# Altium schematic sheet 08 - Resolver.SchDoc: Resolver - 25kW WolfPACK FM3 Six-Pack Inverter
size 431 x 279 mm; Date: 07/2023; DocumentNumber: CRD25DA12N-FMC; Revision: 1.1; SheetNumber: 8; SheetTotal: 8; SheetSize: B
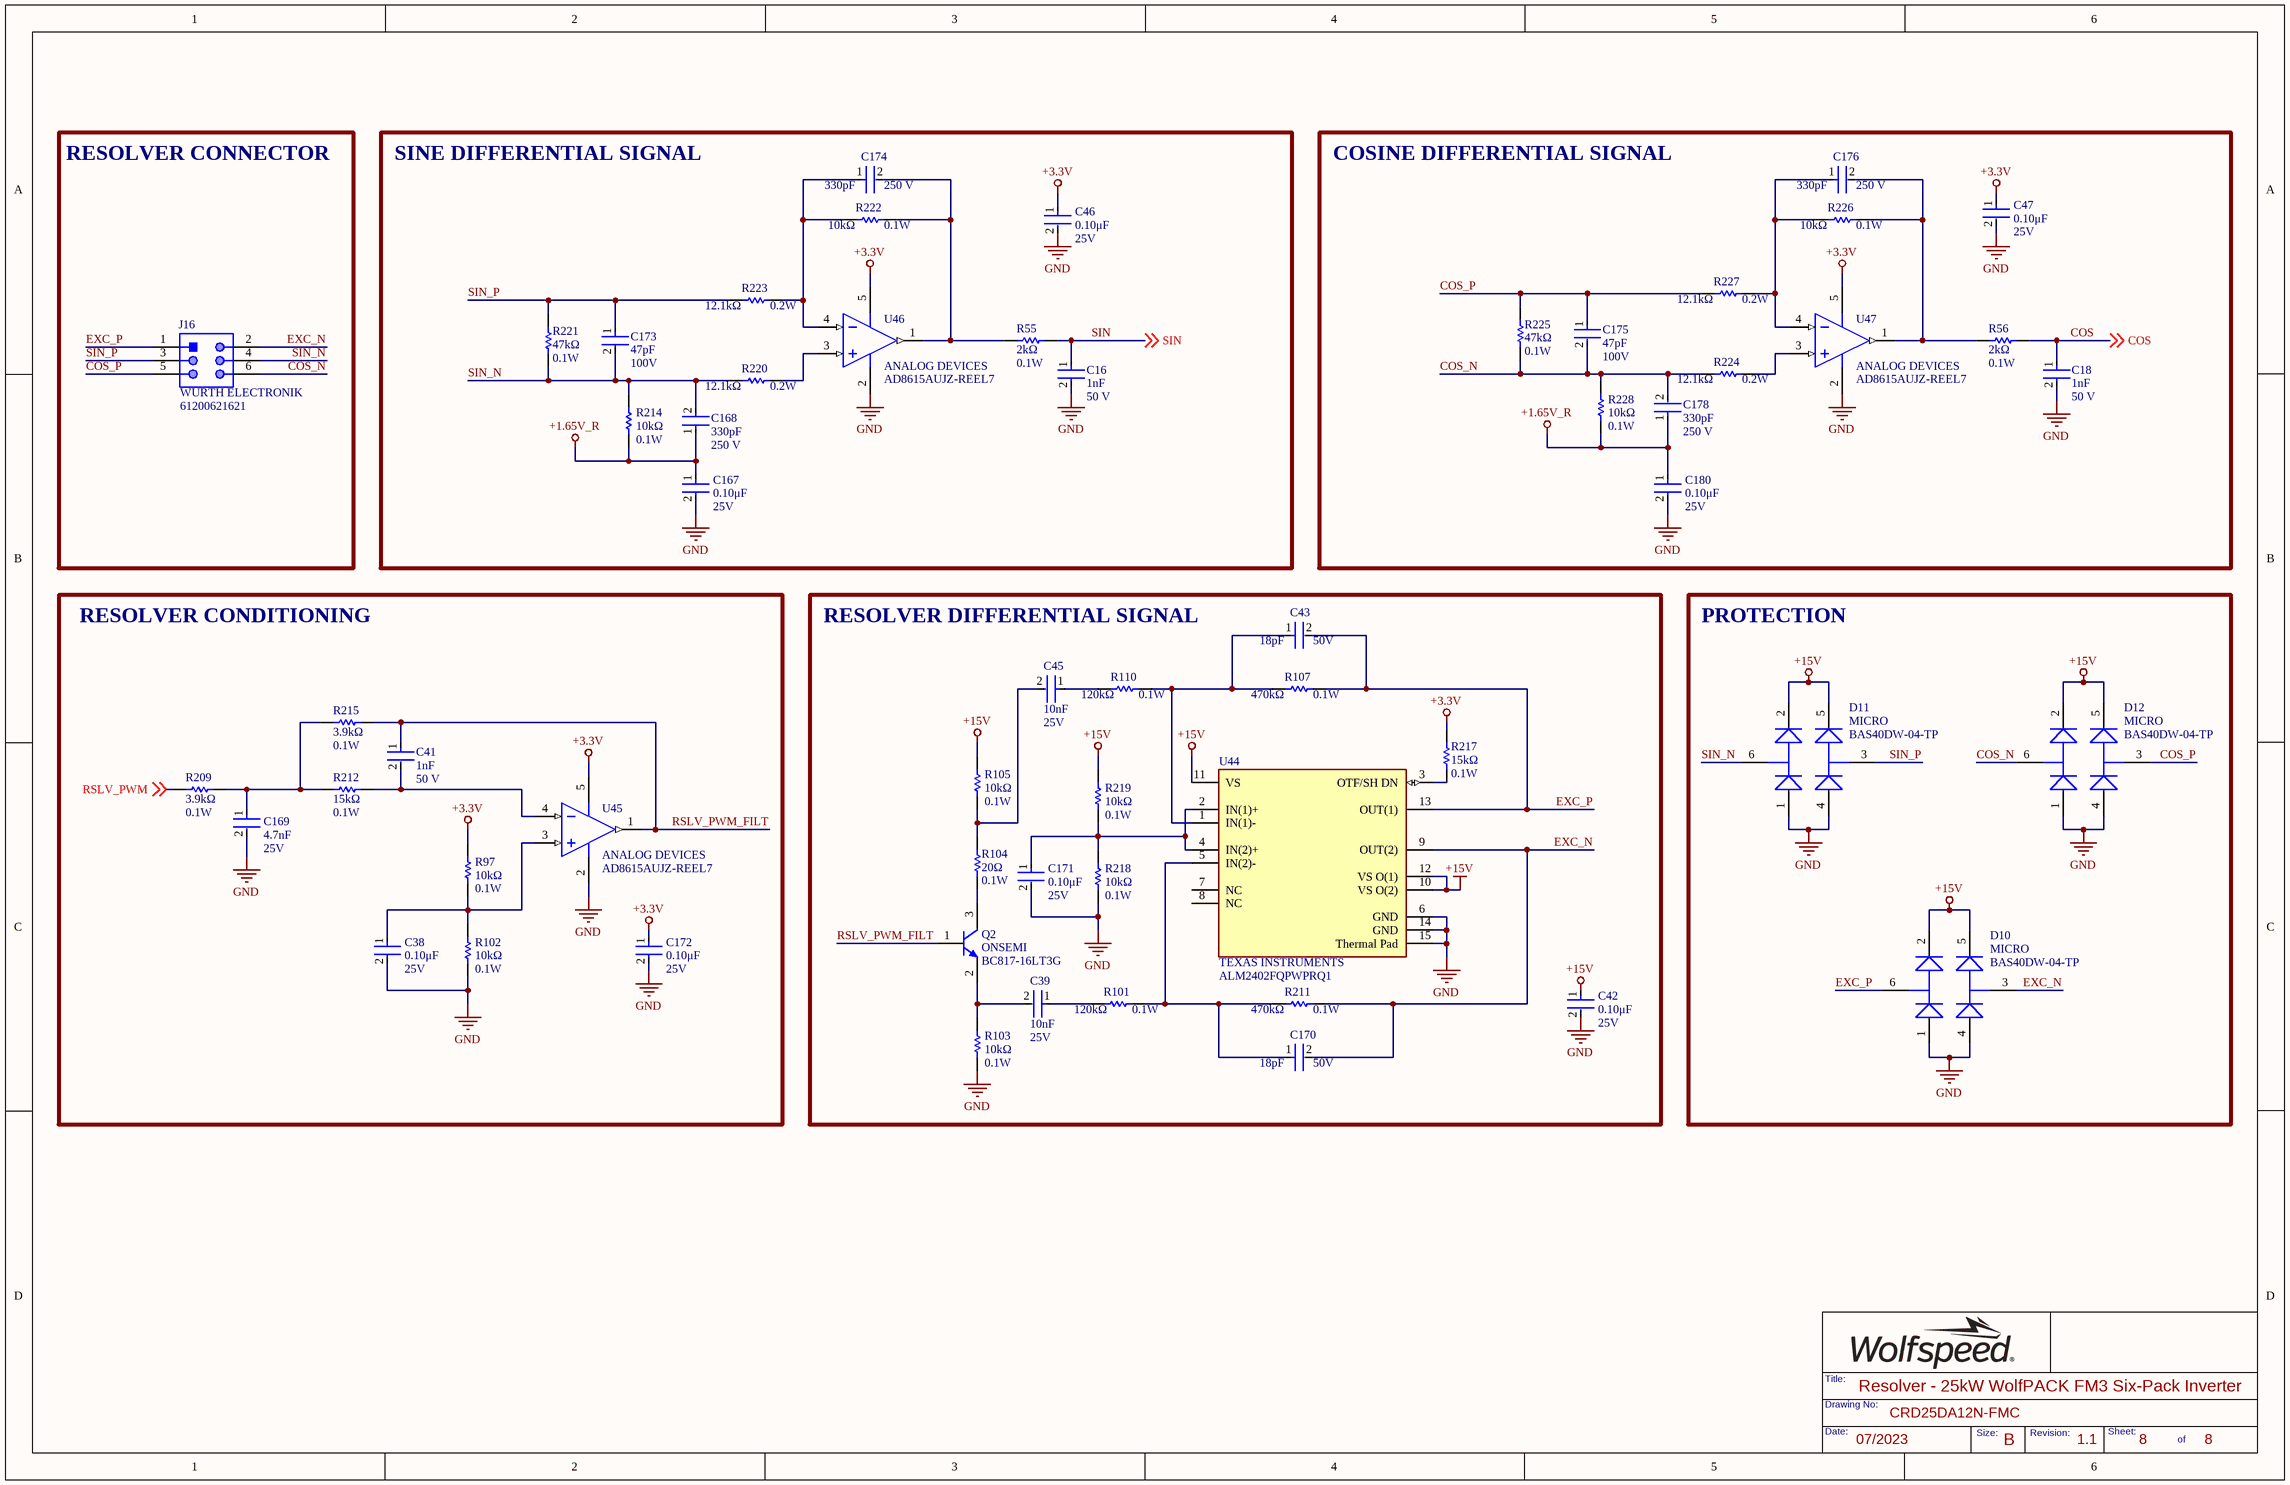
[diagram p0: 08 - Resolver.SchDoc]

## Parts
C16  Capacitance: 1nF  Voltage Rating: 50 V  [FP-C0603C-CF-IPC_B]  (hidden comment: C0603C102K5RACAUTO)
C18  Capacitance: 1nF  Voltage Rating: 50 V  [FP-C0603C-CF-IPC_B]  (hidden comment: C0603C102K5RACAUTO)
C38  Voltage Rating: 25V  Capacitance: 0.10μF  [FP-C0603C-CF-IPC_B]  (hidden comment: C0603C104K3RACTU)
C39  value 10nF  Voltage Rating: 25V  [FP-C0603C-CF-IPC_B]  (hidden comment: CL10B103KA8WPNC)
C41  Capacitance: 1nF  Voltage Rating: 50 V  [FP-C0603C-CF-IPC_B]  (hidden comment: C0603C102K5RACAUTO)
C42  Voltage Rating: 25V  Capacitance: 0.10μF  [FP-C0603C-CF-IPC_B]  (hidden comment: C0603C104K3RACTU)
C43  Capacitance: 18pF  Voltage Rating: 50V  [FP-C0603C-CF-IPC_B]  (hidden comment: 06035A180JAT2A)
C45  value 10nF  Voltage Rating: 25V  [FP-C0603C-CF-IPC_B]  (hidden comment: CL10B103KA8WPNC)
C46  Voltage Rating: 25V  Capacitance: 0.10μF  [FP-C0603C-CF-IPC_B]  (hidden comment: C0603C104K3RACTU)
C47  Voltage Rating: 25V  Capacitance: 0.10μF  [FP-C0603C-CF-IPC_B]  (hidden comment: C0603C104K3RACTU)
C167  Voltage Rating: 25V  Capacitance: 0.10μF  [FP-C0603C-CF-IPC_B]  (hidden comment: C0603C104K3RACTU)
C168  value 330pF  Voltage Rating: 250 V  [FP-C0603C-CF-IPC_B]  (hidden comment: C0603C331JAGAC7867)
C169  Voltage Rating: 25V  Capacitance: 4.7nF  [FP-C0603C-CF-IPC_B]  (hidden comment: C0603C472K3RAC7867)
C170  Capacitance: 18pF  Voltage Rating: 50V  [FP-C0603C-CF-IPC_B]  (hidden comment: 06035A180JAT2A)
C171  Voltage Rating: 25V  Capacitance: 0.10μF  [FP-C0603C-CF-IPC_B]  (hidden comment: C0603C104K3RACTU)
C172  Voltage Rating: 25V  Capacitance: 0.10μF  [FP-C0603C-CF-IPC_B]  (hidden comment: C0603C104K3RACTU)
C173  Capacitance: 47pF  Voltage Rating (DC): 100V  [FP-C0603C-CF-IPC_B]  (hidden comment: C0603C470J1GACTU)
C174  value 330pF  Voltage Rating: 250 V  [FP-C0603C-CF-IPC_B]  (hidden comment: C0603C331JAGAC7867)
C175  Capacitance: 47pF  Voltage Rating (DC): 100V  [FP-C0603C-CF-IPC_B]  (hidden comment: C0603C470J1GACTU)
C176  value 330pF  Voltage Rating: 250 V  [FP-C0603C-CF-IPC_B]  (hidden comment: C0603C331JAGAC7867)
C178  value 330pF  Voltage Rating: 250 V  [FP-C0603C-CF-IPC_B]  (hidden comment: C0603C331JAGAC7867)
C180  Voltage Rating: 25V  Capacitance: 0.10μF  [FP-C0603C-CF-IPC_B]  (hidden comment: C0603C104K3RACTU)
D10  Manufacturer Print: MICRO  [SOT65P222X120-6N]  (hidden comment: BAS40DW-04-TP)
D11  Manufacturer Print: MICRO  [SOT65P222X120-6N]  (hidden comment: BAS40DW-04-TP)
D12  Manufacturer Print: MICRO  [SOT65P222X120-6N]  (hidden comment: BAS40DW-04-TP)
J16  Manufacturer: WURTH ELECTRONIK  [61200621621]  (hidden comment: 61200621621)
Q2  Manufacturer: ONSEMI  [ONSC-SOT-23-3-318-08_V]  (hidden comment: BC817-16LT3G)
R55  Resistance: 2kΩ  Power Rating: 0.1W  [FP-MCR03-IPC_B]  (hidden comment: RT0603DRE072KL)
R56  Resistance: 2kΩ  Power Rating: 0.1W  [FP-MCR03-IPC_B]  (hidden comment: RT0603DRE072KL)
R97  Resistance: 10kΩ  Max Power Dissipation: 0.1W  [FP-MCR03-IPC_B]  (hidden comment: ERJ3EKF1002V)
R101  Max Power Dissipation: 0.1W  Resistance: 120kΩ  [FP-MCR03-IPC_B]  (hidden comment: RC0603FR-07120KL)
R102  Resistance: 10kΩ  Max Power Dissipation: 0.1W  [FP-MCR03-IPC_B]  (hidden comment: ERJ3EKF1002V)
R103  Resistance: 10kΩ  Max Power Dissipation: 0.1W  [FP-MCR03-IPC_B]  (hidden comment: ERJ3EKF1002V)
R104  Resistance: 20Ω  Power Rating: 0.1W  [FP-MCR03-IPC_B]  (hidden comment: RC0603JR-0720RL)
R105  Resistance: 10kΩ  Max Power Dissipation: 0.1W  [FP-MCR03-IPC_B]  (hidden comment: ERJ3EKF1002V)
R107  Resistance: 470kΩ  Power Rating: 0.1W  [FP-MCR03-IPC_B]  (hidden comment: RC0603FR-07470KL)
R110  Max Power Dissipation: 0.1W  Resistance: 120kΩ  [FP-MCR03-IPC_B]  (hidden comment: RC0603FR-07120KL)
R209  Resistance: 3.9kΩ  Power Rating: 0.1W  [FP-MCR03-IPC_B]  (hidden comment: ERJ3EKF3901V)
R211  Resistance: 470kΩ  Power Rating: 0.1W  [FP-MCR03-IPC_B]  (hidden comment: RC0603FR-07470KL)
R212  Resistance: 15kΩ  Power Rating: 0.1W  [FP-MCR03-IPC_B]  (hidden comment: ERA-3AED153V)
R214  Resistance: 10kΩ  Max Power Dissipation: 0.1W  [FP-MCR03-IPC_B]  (hidden comment: ERJ3EKF1002V)
R215  Resistance: 3.9kΩ  Power Rating: 0.1W  [FP-MCR03-IPC_B]  (hidden comment: ERJ3EKF3901V)
R217  Resistance: 15kΩ  Power Rating: 0.1W  [FP-MCR03-IPC_B]  (hidden comment: ERA-3AED153V)
R218  Resistance: 10kΩ  Max Power Dissipation: 0.1W  [FP-MCR03-IPC_B]  (hidden comment: ERJ3EKF1002V)
R219  Resistance: 10kΩ  Max Power Dissipation: 0.1W  [FP-MCR03-IPC_B]  (hidden comment: ERJ3EKF1002V)
R220  Resistance: 12.1kΩ  Max Power Dissipation: 0.2W  [FP-MCR03-IPC_B]  (hidden comment: ERJ-PB3B1212V)
R221  Resistance: 47kΩ  Power Rating: 0.1W  [FP-MCR03-IPC_B]  (hidden comment: RC0603FR-0747KL)
R222  Resistance: 10kΩ  Max Power Dissipation: 0.1W  [FP-MCR03-IPC_B]  (hidden comment: ERJ3EKF1002V)
R223  Resistance: 12.1kΩ  Max Power Dissipation: 0.2W  [FP-MCR03-IPC_B]  (hidden comment: ERJ-PB3B1212V)
R224  Resistance: 12.1kΩ  Max Power Dissipation: 0.2W  [FP-MCR03-IPC_B]  (hidden comment: ERJ-PB3B1212V)
R225  Resistance: 47kΩ  Power Rating: 0.1W  [FP-MCR03-IPC_B]  (hidden comment: RC0603FR-0747KL)
R226  Resistance: 10kΩ  Max Power Dissipation: 0.1W  [FP-MCR03-IPC_B]  (hidden comment: ERJ3EKF1002V)
R227  Resistance: 12.1kΩ  Max Power Dissipation: 0.2W  [FP-MCR03-IPC_B]  (hidden comment: ERJ-PB3B1212V)
R228  Resistance: 10kΩ  Max Power Dissipation: 0.1W  [FP-MCR03-IPC_B]  (hidden comment: ERJ3EKF1002V)
U44  Manufacturer: TEXAS INSTRUMENTS  [FP-PWP0014H-MFG]  (hidden comment: ALM2402FQPWPRQ1)
U45  Manufacturer: ANALOG DEVICES  [ADI-UJ-5_M]  (hidden comment: AD8615AUJZ-REEL7)
U46  Manufacturer: ANALOG DEVICES  [ADI-UJ-5_M]  (hidden comment: AD8615AUJZ-REEL7)
U47  Manufacturer: ANALOG DEVICES  [ADI-UJ-5_M]  (hidden comment: AD8615AUJZ-REEL7)

## Blocks framed on the sheet
RESOLVER CONNECTOR: J16
SINE DIFFERENTIAL SIGNAL: C16 C46 C167 C168 C173 C174 R55 R214 R220-R223 U46
COSINE DIFFERENTIAL SIGNAL: C18 C47 C175 C176 C178 C180 R56 R224-R228 U47
RESOLVER CONDITIONING: C38 C41 C169 C172 R97 R102 R209 R212 R215 U45
RESOLVER DIFFERENTIAL SIGNAL: C39 C42 C43 C45 C170 C171 Q2 R101 R103-R105 R107 R110 R211 R217-R219 U44
PROTECTION: D10-D12

## Nets
+1.65V_R: C167.1 C168.1 C178.1 C180.1 R214.1 R228.1
+3.3V: C46.1 C47.1 C172.1 R97.2 R217.2 U45.5(+V) U46.5(+V) U47.5(+V)
+15V: C42.1 D10.2(C1) D10.5(C2) D11.2(C1) D11.5(C2) D12.2(C1) D12.5(C2) R105.2 R219.2 U44.10(VS_O(2)) U44.11(VS) U44.12(VS_O(1))
GND: C16.2 C18.2 C38.2 C42.2 C46.2 C47.2 C167.2 C169.2 C171.2 C172.2 C180.2 D10.1(A1) D10.4(A2) D11.1(A1) D11.4(A2) D12.1(A1) D12.4(A2) R102.1 R103.1 R218.1 U44.6(GND) U44.14(GND) U44.15(Thermal_Pad) U45.2(-V) U46.2(-V) U47.2(-V)
COS: C18.1 R56.2 ; off-sheet COS
COS_N: C175.2 C178.2 D12.6(AC1) J16.6 R224.1 R225.1 R228.2
COS_P: C175.1 D12.3(AC2) J16.5 R225.2 R227.1
EXC_N: C170.2 D10.3(AC2) J16.2 R211.2 U44.9(OUT(2))
EXC_P: C43.2 D10.6(AC1) J16.1 R107.2 U44.13(OUT(1))
RSLV_PWM: R209.1 ; off-sheet RSLV_PWM
RSLV_PWM_FILT: C41.1 Q2.1(B) R215.2 U45.1(OUT)
SIN: C16.1 R55.2 ; off-sheet SIN
SIN_N: C168.2 C173.2 D11.6(AC1) J16.4 R214.2 R220.1 R221.1
SIN_P: C173.1 D11.3(AC2) J16.3 R221.2 R223.1
NetC38_1: C38.1 R97.1 R102.2 U45.3(+IN)
NetC39_1: C39.1 R101.1
NetC39_2: C39.2 Q2.2(E) R103.2
NetC41_2: C41.2 R212.1 U45.4(-IN)
NetC43_1: C43.1 R107.1 R110.2 U44.1(IN(1)-)
NetC45_1: C45.1 R110.1
NetC45_2: C45.2 R104.2 R105.1
NetC169_1: C169.1 R209.2 R212.2 R215.1
NetC170_1: C170.1 R101.2 R211.1 U44.5(IN(2)-)
NetC171_1: C171.1 R218.2 R219.1 U44.2(IN(1)+) U44.4(IN(2)+)
NetC174_1: C174.1 R222.2 R223.2 U46.4(-IN)
NetC174_2: C174.2 R55.1 R222.1 U46.1(OUT)
NetC176_1: C176.1 R226.2 R227.2 U47.4(-IN)
NetC176_2: C176.2 R56.1 R226.1 U47.1(OUT)
NetQ2_3: Q2.3(C) R104.1
NetR217_1: R217.1 U44.3(OTF/SH_DN)
NetR220_2: R220.2 U46.3(+IN)
NetR224_2: R224.2 U47.3(+IN)

Not connected (* = marked no-connect by the designer): U44 7(NC) 8(NC)

## Notes on the sheet
- Title:
- Date:
- Drawing No:
- Size:
- Revision:
- Sheet:
- of

## Library data of the parts
C16 C18 C41 = CMP-2006-03716-2: CAP CER 1000PF 50V X7R 0603; Manufacturer: KEMET; Material: Ceramic; Automotive Grade: Grade 1; Value: 1nF; Tolerance: 0.1; Temperature Coefficient: 30ppm/°C; Category: Cap; Automotive: Yes; Temperature Range High: +125°C; Temperature Range Low: -55°C; Temperature Characteristic: X7R; Device Class L1: Passive Components; Height: 0.87mm; Lead Free: Yes; Package: 0603; Digikey Description: CAP CER 1000PF 50V X7R 0603; Manufacturer Part Number: C0603C102K5RACAUTO; ComponentLink2URL: https://api.kemet.com/component-edge/download/datasheet/C0603C100J5GACAUTO.pdf; Mouser Description: Multilayer Ceramic Capacitors MLCC - SMD/SMT 1000pF 50volts 10% X7R AUTO; RoHS: TRUE; Octopart: https://octopart.com/c0603c102k5racauto-kemet-18822673; Device Class L3: Ceramic Capacitors; ComponentLink2Description: Datasheet; Device Class L2: Capacitors; Temperature: -55°C to +125°C
C38 C42 C46 C47 C167 C171 C172 C180 = CMP-2006-03057-2: CAP CER 0.1UF 25V X7R 0603; Manufacturer: KEMET; Value: 0.10μF; Material: Ceramic; Tolerance: 0.1; Temperature Coefficient: 30ppm/°C; Automotive Grade: Grade 1; Lead Free: Yes; Device Class L3: Ceramic Capacitors; Manufacturer Part Number: C0603C104K3RACTU; Digikey Description: CAP CER 0.1UF 25V X7R 0603; Mouser Description: Multilayer Ceramic Capacitors MLCC - SMD/SMT 25volts 0.1uF X7R 10%; Package: 0603; Temperature Range Low: -55°C; Automotive: Yes; Device Class L2: Capacitors; Octopart: https://octopart.com/c0603c104k3ractu-kemet-127541; ComponentLink2Description: Datasheet; ComponentLink2URL: https://api.kemet.com/component-edge/download/datasheet/C0603C100J5GACAUTO.pdf; Temperature Range High: +125°C; RoHS: TRUE; Device Class L1: Passive Components; Category: Cap; Temperature: -55°C to +125°C; Height: 0.87mm; Temperature Characteristic: X7R
C39 C45 = CL10B103KA8WPNC: CAP CER 10000PF 25V X7R 0603; Manufacturer: SAMSUNG; Tolerance: 10%; Supplier 1: Arrow Electronics; Manufacturer Part Number: CL10B103KA8WPNC; RoHS: Yes; Category: Ceramic Capacitors; Stock 1: 144000; Pricing 1: 4000=0.00760, 8000=0.00670, 28000=0.00660, 100000=0.00500 (USD); Mount: Surface Mount; Package: 0603; Case Code (Metric): 1608; Case Code (Imperial): 0603; Min Operating Temperature: -55°C; Max Operating Temperature: 125°C; Packaging: Tape and Reel; Capacitance: 10nF; Features: Soft Termination; Length: 0.063inch; Width: 0.031inch; Thickness: 0.035inch; Ratings: AEC-Q200; RoHS Compliant: Yes; ComponentLink1URL: http://www.samsungsem.com/kr/support/product-search/mlcc/CL10B103KA8WPNC.jsp?src-supplier=Digi-Key; ComponentLink1Description: http://www.samsungsem.com/kr/support/product-search/mlcc/CL10B103KA8WPNC.jsp?src-supplier=Digi-Key; ComponentLink2URL: http://www.samsungsem.com/kr/support/library/product-catalog/mlcc.jsp?src-supplier=Digi-Key; ComponentLink2Description: http://www.samsungsem.com/kr/support/library/product-catalog/mlcc.jsp?src-supplier=Digi-Key; ComponentLink3URL: http://www.samsungsem.com/servlet/FileDownload?filename=productcatalog/pdf/MLCC.pdf&src-supplier=Avnet; ComponentLink3Description: http://www.samsungsem.com/servlet/FileDownload?filename=productcatalog/pdf/MLCC.pdf&src-supplier=Avnet; Supplier Part Number 1: CL10B103KA8WPNC
C43 C170 = 06035A180JAT2A: CAP CER 18PF 50V C0G/NP0 0603; Manufacturer: KYOCERA AVX; Dielectric Material: Ceramic; Tolerance: 5%; Dielectric: C0G; Insulation Resistance: 100GR; Temperature Coefficient: 30ppm/°C; Supplier 1: Rs; Manufacturer Part Number: 06035A180JAT2A; RoHS: Yes; Category: Ceramic Capacitors; Stock 1: 1; Pricing 1: 4000=0.01900, 12000=0.01700 (USD); Mount: Surface Mount; Number of Pins: 2; Case Code (Imperial): 0603; Case Code (Metric): 1608; Contact Plating: Tin,Matte; Min Operating Temperature: -55°C; Max Operating Temperature: 125°C; Packaging: Tape and Reel; Voltage Rating (DC): 50V; Series: -; Package Quantity: 1; Termination: SMD/SMT; Voltage: 50V; Length: 1.6mm; Width: 0.032inch; Height: 0.86mm; Thickness: 0.035inch; Depth: 0.81mm; Radiation Hardening: No; Reach SVHC Compliant: Yes; Lead Free: Lead Free; RoHS Compliant: Yes; ComponentLink1URL: https://datasheet.ciiva.com/1124/84496-1124722.pdf?src-supplier=Element14; ComponentLink1Description: https://datasheet.ciiva.com/1124/84496-1124722.pdf?src-supplier=Element14; ComponentLink2URL: https://datasheet.ciiva.com/22699/84496-22699967.pdf?src-supplier=Element14; ComponentLink2Description: https://datasheet.ciiva.com/22699/84496-22699967.pdf?src-supplier=Element14; ComponentLink3URL: https://datasheet.ciiva.com/7855/759117-7855062.pdf?src-supplier=Element14; ComponentLink3Description: https://datasheet.ciiva.com/7855/759117-7855062.pdf?src-supplier=Element14; ComponentLink4URL: https://datasheet.ciiva.com/7855/84496-7855222.pdf?src-supplier=Element14; ComponentLink4Description: https://datasheet.ciiva.com/7855/84496-7855222.pdf?src-supplier=Element14; ComponentLink5URL: https://datasheet.ciiva.com/150/ccog-150276.pdf?src-supplier=Digi-Key; ComponentLink5Description: https://datasheet.ciiva.com/150/ccog-150276.pdf?src-supplier=Digi-Key; ComponentLink6URL: https://datasheet.ciiva.com/150/ccog-150277.pdf?src-supplier=Digi-Key; ComponentLink6Description: https://datasheet.ciiva.com/150/ccog-150277.pdf?src-supplier=Digi-Key; Supplier Part Number 1: 1349617; Package: 0603; Value: 18pF
C168 C174 C176 C178 = CMP-03020-020944-2: CAP CER 330PF 250V C0G/NP0 0603; Manufacturer: KEMET; Material: Ceramic; Temperature Coefficient: 30ppm/°C; Tolerance: 0.05; Automotive Grade: Grade 1; Temperature Characteristic: C0G; Octopart: https://octopart.com/c0603c331jagac7867-kemet-83501965; Manufacturer Part Number: C0603C331JAGAC7867; Height: 0.87mm; ComponentLink2URL: https://api.kemet.com/component-edge/download/datasheet/C0603C100J5GACAUTO.pdf; Capacitance: 330pF; Package: 0603; Category: Cap; Temperature Range High: +125°C; RoHS: TRUE; ComponentLink2Description: Datasheet; Automotive: Yes; Temperature Range Low: -55°C; Temperature: -55°C to +125°C; Device Class L3: Ceramic Capacitors; Device Class L2: Capacitors; Digikey Description: Cap Ceramic 330pF 250V C0G 5% SMD 0603 125°C Paper T/R; Device Class L1: Passive Components; Lead Free: Yes
C169 = C0603C472K3RAC7867: CAP CER 4700PF 25V 10% X7R 0603; Manufacturer: KEMET; Manufacturer Part Number: C0603C472K3RACTU; Dielectric Material: Ceramic; Value: 4.7nF; Supplier 1: Newark; RoHS: Yes; Category: Ceramic Capacitors; Stock 1: 8000; Pricing 1: 1=0.04800, 4000=0.04800 (USD); Mount: Surface Mount; Package: 0603; Case Code (Metric): 1608; Case Code (Imperial): 0603; Min Operating Temperature: -55°C; Max Operating Temperature: 125°C; Tolerance: 10%; Dielectric: X7R; Packaging: Tape and Reel; Package Quantity: 1; Voltage Rating (DC): 25V; Termination: SMD/SMT; Dissipation Factor: 10%; Series: C; Construction: Flat; Length: 1.6mm; Width: 0.031inch; Height: 0.8mm; Thickness: 0.034inch; Lead Pitch: 0.7mm; Depth: 0.8mm; Radiation Hardening: No; Reach SVHC Compliant: Yes; RoHS Compliant: Yes; ComponentLink1URL: https://datasheet.ciiva.com/5414/kem-c1002-x7r-smd-357932-5414293.pdf?src-supplier=Mouser; ComponentLink1Description: https://datasheet.ciiva.com/5414/kem-c1002-x7r-smd-357932-5414293.pdf?src-supplier=Mouser; Supplier Part Number 1: 67AH9250
C173 C175 = C0603C470J1GACTU: CAP CER 47PF 100V C0G/NP0 0603; Manufacturer: KEMET; Dielectric Material: Ceramic; Tolerance: 5%; Dielectric: C0G; Temperature Coefficient: 30ppm/°C; Dissipation Factor: 0.1%; Supplier 1: Rs; Manufacturer Part Number: C0603C470J1GACTU; RoHS: Yes; Category: Ceramic Capacitors; Stock 1: 1; Pricing 1: 100=0.04300, 1000=0.03200, 2000=0.02200, 4000=0.02100, 8000=0.02000 (USD); Mount: Surface Mount,PCB; Package: 0603; Number of Pins: 2; Case Code (Imperial): 0603; Case Code (Metric): 1608; Min Operating Temperature: -55°C; Max Operating Temperature: 125°C; Package Quantity: 4000; Voltage Rating: 100V; Packaging: Tape and Reel; Termination: SMD/SMT; Voltage: 100V; Series: C; Construction: Flat; Length: 1.6mm; Width: 0.031inch; Height: 0.8mm; Lead Pitch: 0.7mm; Thickness: 0.034inch; Depth: 0.8mm; Radiation Hardening: No; Reach SVHC Compliant: Yes; Lead Free: Lead Free; RoHS Compliant: Yes; ComponentLink1URL: https://datasheet.ciiva.com/28668/1789732-28668693.pdf?src-supplier=Element14; ComponentLink1Description: https://datasheet.ciiva.com/28668/1789732-28668693.pdf?src-supplier=Element14; Supplier Part Number 1: 8015369; Value: 47pF
D10-D12 = BAS40DW-04-TP: DIODE ARRAY SCHOTTKY 40V SOT363; Manufacturer_Name: Micro Commercial Components (MCC); Manufacturer: MICRO COMMERCIAL; Class: DIO; Height: 1.2mm; Manufacturer_Part_Number: BAS40DW-04-TP; Package: SOT-363; Value: N/A; Manufacturer Part Number: BAS40DW-04-TP
J16 = CMP-1502-00000-1: CONN HEADER VERT 6POS 2.54MM; Withstanding Voltage: 500VAC; Working Voltage: 250VAC; Pin Number: 6; Gender: Male; Contact Resistance: 20mOhm; Manufacturer Part Number: 61200621621; Manufacturer URL: http://www.we-online.de; Published Date: August2018; Orientation: Vertical; Publisher: WurthElektronik; Operating Temperature: -40to125degC; Datasheet URL: https://katalog.we-online.de/em/datasheet/6120xx21621.pdf; Pitch: 2.54mm; Mounting Technology: THT; Packaging: Tray; Package Reference: 61200621621; Value: N/A; Package: N/A
Q2 = CMP-1048-00731-1: TRANS NPN 45V 0.5A SOT23-3; IC Continuous (A): 0.5; Packing: Tape and Reel; fT Min (MHz): 100; PartNumber: BC817-16LT3G; DatasheetVersion: Rev. 12; ComponentLink3URL: http://www.onsemi.cn/pub_link/Collateral/318-08.PDF; PackageDescription: 3-Pin Small Outline Transistor, Body 2.92 x 1.3 mm, Pitch 0.95 mm; Polarity: NPN; ComponentLink3Description: Package Specification; Mounting Technology: Surface Mount; PackageReference: SOT-23-3-318-08; RoHS: TRUE; ComponentLink1Description: Manufacturer URL; PackageVersion: Rev. AP, 11/2009; ComponentLink2URL: http://www.onsemi.com/pub_link/Collateral/BC817-16LT1-D.PDF; ComponentLink2Description: Datasheet; ComponentLink1URL: http://www.onsemi.com/; Package: SOT-23-3; Value: N/A; Manufacturer Part Number: BC817-16LT3G
R55 R56 = RT0603DRE072KL: RES SMD 2K OHM 0.5% 1/10W 0603; Manufacturer: YAGEO; Temperature Coefficient: 50ppm/°C; Voltage Rating: 75V; Max Power Dissipation: 100mW; Voltage Rating (DC): 50V; Value: 2kΩ; Supplier 1: Future Electronics; Manufacturer Part Number: RT0603DRE072KL; RoHS: Yes; Category: Chip SMD Resistors; Stock 1: 5000; Pricing 1: 5000=0.00650, 20000=0.00620, 75000=0.00590, 125000=0.00580, 250000=0.00550 (USD); Package: 0603; Contact Plating: Tin,Matte; Case Code (Metric): 1608; Case Code (Imperial): 0603; Min Operating Temperature: -55°C; Max Operating Temperature: 125°C; Tolerance: 0.5%; Resistor Type: Thin Film; Packaging: Tape and Reel; Package Quantity: 5000; Number of Terminations: 2; Termination: SMD/SMT; Features: Moisture Resistant; Series: RT; Construction: Rectangular; Length: 0.063inch; Width: 0.031inch; Height: 0.022inch; Depth: 0.8mm; Radiation Hardening: No; Military Standard: Not; Lead Free: Lead Free; RoHS Compliant: Yes; ComponentLink1URL: https://datasheet.ciiva.com/2566/pyu-rt-1-to-0-05-rohs-l-5-2566187.pdf?src-supplier=Digi-Key; ComponentLink1Description: https://datasheet.ciiva.com/2566/pyu-rt-1-to-0-05-rohs-l-5-2566187.pdf?src-supplier=Digi-Key; ComponentLink2URL: https://datasheet.ciiva.com/12705/pyu-rt-1-to-0-05-rohs-l-4-12705391.pdf?src-supplier=Mouser; ComponentLink2Description: https://datasheet.ciiva.com/12705/pyu-rt-1-to-0-05-rohs-l-4-12705391.pdf?src-supplier=Mouser; Supplier Part Number 1: 6165116
R97 R102 R103 R105 R214 R218 R219 R222 R226 R228 = ERJ3EKF1002V: RES SMD 10K OHM 1% 1/10W 0603; Manufacturer: PANASONIC; Manufacturer Part Number: ERJ-3EKF1002V; Temperature Coefficient: 100ppm/°C; Power Rating: 100mW; Voltage Rating: 75V; Value: 10kΩ; Supplier 1: Rs; RoHS: Yes; Category: Chip SMD Resistors; Stock 1: 10000; Mount: Surface Mount; Package: 0603; Number of Pins: 2; Contact Plating: Tin; Case Code (Metric): 1608; Case Code (Imperial): 0603; Size Code: 0603; Min Operating Temperature: -55°C; Max Operating Temperature: 155°C; Tolerance: 1%; Resistor Type: Thick Film; Packaging: Tape and Reel; Package Quantity: 1; Number of Terminations: 2; Termination: SMD/SMT; Voltage Rating (DC): 75V; Features: Automotive AEC-Q200; Series: ERJ; Technology: THICK FILM; Resistance Tolerance: 1%; Construction: Rectangular; Length: 1.6mm; Width: 0.8mm; Height: 0.45mm; Depth: 0.8mm; Radiation Hardening: No; Reach SVHC Compliant: Yes; Military Standard: Not; Lead Free: Lead Free; RoHS Compliant: Yes; ComponentLink1URL: https://datasheet.ciiva.com/7830/aoa0000ce2-7830729.pdf?src-supplier=Element14; ComponentLink1Description: https://datasheet.ciiva.com/7830/aoa0000ce2-7830729.pdf?src-supplier=Element14; ComponentLink2URL: https://datasheet.ciiva.com/46372/1678782-46372725.pdf?src-supplier=Element14; ComponentLink2Description: https://datasheet.ciiva.com/46372/1678782-46372725.pdf?src-supplier=Element14; ComponentLink3URL: https://datasheet.ciiva.com/28514/426256-28514198.pdf?src-supplier=Element14; ComponentLink3Description: https://datasheet.ciiva.com/28514/426256-28514198.pdf?src-supplier=Element14; ComponentLink4URL: https://datasheet.ciiva.com/24070/aoa0000ce2-24070318.pdf?src-supplier=Mouser; ComponentLink4Description: https://datasheet.ciiva.com/24070/aoa0000ce2-24070318.pdf?src-supplier=Mouser; ComponentLink5URL: https://datasheet.ciiva.com/16759/70260748-16759807.pdf?src-supplier=Allied+Electronics; ComponentLink5Description: https://datasheet.ciiva.com/16759/70260748-16759807.pdf?src-supplier=Allied+Electronics; ComponentLink6URL: https://datasheet.ciiva.com/9194/aoa0000ce2-9194199.pdf?src-supplier=Avnet; ComponentLink6Description: https://datasheet.ciiva.com/9194/aoa0000ce2-9194199.pdf?src-supplier=Avnet; ComponentLink7URL: https://datasheet.ciiva.com/48530/aoa0000ce2-48530988.pdf?src-supplier=Avnet; ComponentLink7Description: https://datasheet.ciiva.com/48530/aoa0000ce2-48530988.pdf?src-supplier=Avnet; ComponentLink8URL: https://datasheet.ciiva.com/30208/aoa0000ce2-30208985.pdf?src-supplier=Onlinecomponents.com; ComponentLink8Description: https://datasheet.ciiva.com/30208/aoa0000ce2-30208985.pdf?src-supplier=Onlinecomponents.com; Supplier Part Number 1: 1051156
R101 R110 = RC0603FR-07120KL: RES 120K OHM 1% 1/10W 0603; Manufacturer: YAGEO; Power Rating: 100mW; Voltage Rating: 50V; Temperature Coefficient: 100ppm/°C; Working Voltage: 75V; Value: 120kΩ; Supplier 1: Future Electronics; Manufacturer Part Number: RC0603FR-07120KL; RoHS: Yes; Category: Chip SMD Resistors; Stock 1: 4140000; Pricing 1: 5000=0.00150, 75000=0.00140, 200000=0.00140, 750000=0.00130, 2000000=0.00120 (USD); Package: 0603; Number of Pins: 2; Case Code (Metric): 1608; Case Code (Imperial): 0603; Min Operating Temperature: -55°C; Max Operating Temperature: 155°C; Tolerance: 1%; Resistor Type: Thick Film; Voltage Rating (DC): 50V; Package Quantity: 5000; Packaging: Tape and Reel; Number of Terminations: 2; Termination: SMD/SMT; Features: Moisture Resistant; Series: RC; Resistance Tolerance: 1%; Technology: THICK FILM; Length: 0.063inch; Width: 0.031inch; Height: 0.022inch; Depth: 0.8mm; RoHS Compliant: Yes; Lead Free: Lead Free; ComponentLink1URL: https://datasheet.ciiva.com/11808/0900766b80f96399-11808757.pdf?src-supplier=Rs; ComponentLink1Description: https://datasheet.ciiva.com/11808/0900766b80f96399-11808757.pdf?src-supplier=Rs; ComponentLink2URL: https://datasheet.ciiva.com/2454/pyu-r-int-thick-7-2454739.pdf?src-supplier=Digi-Key; ComponentLink2Description: https://datasheet.ciiva.com/2454/pyu-r-int-thick-7-2454739.pdf?src-supplier=Digi-Key; ComponentLink3URL: https://datasheet.ciiva.com/2454/pyu-r-int-thick-7-2454740.pdf?src-supplier=Digi-Key; ComponentLink3Description: https://datasheet.ciiva.com/2454/pyu-r-int-thick-7-2454740.pdf?src-supplier=Digi-Key; ComponentLink4URL: https://datasheet.ciiva.com/2454/pyu-r-int-thick-7-2454738.pdf?src-supplier=Digi-Key; ComponentLink4Description: https://datasheet.ciiva.com/2454/pyu-r-int-thick-7-2454738.pdf?src-supplier=Digi-Key; ComponentLink5URL: https://datasheet.ciiva.com/7746/443971-7746247.pdf?src-supplier=Element14; ComponentLink5Description: https://datasheet.ciiva.com/7746/443971-7746247.pdf?src-supplier=Element14; ComponentLink6URL: https://datasheet.ciiva.com/7746/443971-7746246.pdf?src-supplier=Element14; ComponentLink6Description: https://datasheet.ciiva.com/7746/443971-7746246.pdf?src-supplier=Element14; Supplier Part Number 1: 5577309
R104 = RC0603JR-0720RL: RES 20 OHM 5% 1/10W 0603; Manufacturer: YAGEO; Temperature Coefficient: 100ppm/°C; Voltage Rating (DC): 50V; Voltage Rating: 75V; Max Power Dissipation: 100mW; Value: 20Ω; Supplier 1: Future Electronics; Manufacturer Part Number: RC0603JR-0720RL; RoHS: Yes; Category: Chip SMD Resistors; Stock 1: 490000; Pricing 1: 5000=0.00110, 75000=0.00100, 250000=0.00100, 750000=0.00090, 2500000=0.00080 (USD); Package: 0603; Case Code (Imperial): 0603; Case Code (Metric): 1608; Weight: 7.1E-05oz; Size Code: 0603; Min Operating Temperature: -55°C; Max Operating Temperature: 155°C; Tolerance: 5%; Resistor Type: Thick Film; Packaging: Tape and Reel; Package Quantity: 1; Termination: SMD/SMT; Number of Terminations: 2; Features: Moisture Resistant; Series: RC; Construction: Rectangular; Resistance Tolerance: 5%; Length: 0.063inch; Width: 0.031inch; Height: 0.022inch; Depth: 0.8mm; Lead Free: Lead Free; Military Standard: Not; RoHS Compliant: Yes; ComponentLink1URL: https://datasheet.ciiva.com/2453/pyu-r-int-thick-7-2453212.pdf?src-supplier=Digi-Key; ComponentLink1Description: https://datasheet.ciiva.com/2453/pyu-r-int-thick-7-2453212.pdf?src-supplier=Digi-Key; ComponentLink2URL: https://datasheet.ciiva.com/2453/pyu-r-int-thick-7-2453213.pdf?src-supplier=Digi-Key; ComponentLink2Description: https://datasheet.ciiva.com/2453/pyu-r-int-thick-7-2453213.pdf?src-supplier=Digi-Key; ComponentLink3URL: https://datasheet.ciiva.com/2453/pyu-r-int-thick-7-2453211.pdf?src-supplier=Digi-Key; ComponentLink3Description: https://datasheet.ciiva.com/2453/pyu-r-int-thick-7-2453211.pdf?src-supplier=Digi-Key; Supplier Part Number 1: 4144481
R107 R211 = RC0603FR-07470KL: RES 470K OHM 1% 1/10W 0603; Manufacturer: YAGEO; Temperature Coefficient: 100ppm/°C; Voltage Rating: 50V; Max Power Dissipation: 100mW; Value: 470kΩ; Supplier 1: Future Electronics; Manufacturer Part Number: RC0603FR-07470KL; RoHS: Yes; Category: Chip SMD Resistors; Stock 1: 8340000; Pricing 1: 5000=0.00150, 50000=0.00140, 200000=0.00140, 625000=0.00130, 2000000=0.00120 (USD); Package: 0603; Number of Pins: 2; Case Code (Imperial): 0603; Case Code (Metric): 1608; Size Code: 0603; Min Operating Temperature: -55°C; Max Operating Temperature: 155°C; Tolerance: 1%; Series: RC; Packaging: Tape and Reel; Voltage Rating (DC): 50V; Package Quantity: 1; Termination: SMD/SMT; Resistor Type: Thick Film; Number of Terminations: 2; Features: Moisture Resistant; Resistance Tolerance: 1%; Construction: Rectangular; Length: 0.063inch; Width: 0.031inch; Height: 0.022inch; Depth: 0.8mm; RoHS Compliant: Yes; Reach SVHC Compliant: Yes; Military Standard: Not; Lead Free: Lead Free; ComponentLink1URL: https://datasheet.ciiva.com/46440/1868787-46440906.pdf?src-supplier=Element14; ComponentLink1Description: https://datasheet.ciiva.com/46440/1868787-46440906.pdf?src-supplier=Element14; ComponentLink2URL: https://datasheet.ciiva.com/2454/pyu-r-int-thick-7-2454121.pdf?src-supplier=Digi-Key; ComponentLink2Description: https://datasheet.ciiva.com/2454/pyu-r-int-thick-7-2454121.pdf?src-supplier=Digi-Key; ComponentLink3URL: https://datasheet.ciiva.com/2454/pyu-r-int-thick-7-2454122.pdf?src-supplier=Digi-Key; ComponentLink3Description: https://datasheet.ciiva.com/2454/pyu-r-int-thick-7-2454122.pdf?src-supplier=Digi-Key; ComponentLink4URL: https://datasheet.ciiva.com/2454/pyu-r-int-thick-7-2454120.pdf?src-supplier=Digi-Key; ComponentLink4Description: https://datasheet.ciiva.com/2454/pyu-r-int-thick-7-2454120.pdf?src-supplier=Digi-Key; ComponentLink5URL: https://datasheet.ciiva.com/7746/443971-7746358.pdf?src-supplier=Element14; ComponentLink5Description: https://datasheet.ciiva.com/7746/443971-7746358.pdf?src-supplier=Element14; ComponentLink6URL: https://datasheet.ciiva.com/7746/443971-7746357.pdf?src-supplier=Element14; ComponentLink6Description: https://datasheet.ciiva.com/7746/443971-7746357.pdf?src-supplier=Element14; Supplier Part Number 1: 4599155
R209 R215 = ERJ3EKF3901V: RES SMD 3.9K OHM 1% 1/10W 0603; Manufacturer: PANASONIC; Manufacturer Part Number: ERJ-3EKF3901V; Temperature Coefficient: 100ppm/°C; Voltage Rating: 75V; Max Power Dissipation: 100mW; Value: 3.9kΩ; Supplier 1: Rs; RoHS: Yes; Category: Chip SMD Resistors; Stock 1: 1; Pricing 1: 5000=0.00700 (USD); Mount: Surface Mount; Package: 0603; Number of Pins: 2; Contact Plating: Tin; Case Code (Metric): 1608; Case Code (Imperial): 0603; Min Operating Temperature: -55°C; Max Operating Temperature: 155°C; Tolerance: 1%; Resistor Type: Thick Film; Packaging: Tape and Reel; Package Quantity: 1; Number of Terminations: 2; Termination: SMD/SMT; Voltage Rating (DC): 75V; Features: Automotive AEC-Q200; Series: ERJ; Resistance Tolerance: 1%; Construction: Rectangular; Length: 1.6mm; Width: 0.8mm; Height: 0.022inch; Depth: 0.8mm; Radiation Hardening: No; Reach SVHC Compliant: Yes; Military Standard: Not; Lead Free: Lead Free; RoHS Compliant: Yes; ComponentLink1URL: https://datasheet.ciiva.com/7802/426256-7802685.pdf?src-supplier=Element14; ComponentLink1Description: https://datasheet.ciiva.com/7802/426256-7802685.pdf?src-supplier=Element14; ComponentLink2URL: https://datasheet.ciiva.com/28568/1678782-28568860.pdf?src-supplier=Element14; ComponentLink2Description: https://datasheet.ciiva.com/28568/1678782-28568860.pdf?src-supplier=Element14; ComponentLink3URL: https://datasheet.ciiva.com/46419/1678782-46419999.pdf?src-supplier=Element14; ComponentLink3Description: https://datasheet.ciiva.com/46419/1678782-46419999.pdf?src-supplier=Element14; ComponentLink4URL: https://datasheet.ciiva.com/16759/70260748-16759613.pdf?src-supplier=Allied+Electronics; ComponentLink4Description: https://datasheet.ciiva.com/16759/70260748-16759613.pdf?src-supplier=Allied+Electronics; ComponentLink5URL: https://datasheet.ciiva.com/9117/aoa0000ce2-9117242.pdf?src-supplier=Avnet; ComponentLink5Description: https://datasheet.ciiva.com/9117/aoa0000ce2-9117242.pdf?src-supplier=Avnet; ComponentLink6URL: https://datasheet.ciiva.com/9196/aoa0000ce2-9196154.pdf?src-supplier=Avnet; ComponentLink6Description: https://datasheet.ciiva.com/9196/aoa0000ce2-9196154.pdf?src-supplier=Avnet; ComponentLink7URL: https://datasheet.ciiva.com/30213/aoa0000ce2-30213118.pdf?src-supplier=Onlinecomponents.com; ComponentLink7Description: https://datasheet.ciiva.com/30213/aoa0000ce2-30213118.pdf?src-supplier=Onlinecomponents.com; Supplier Part Number 1: 1229307
R212 R217 = ERA-3AED153V: RES SMD 15K OHM 0.5% 1/10W 0603; Manufacturer: PANASONIC; Voltage Rating: 75V; Temperature Coefficient: 25ppm/°C; Max Power Dissipation: 100mW; Value: 15kΩ; Supplier 1: Digi-Key; Manufacturer Part Number: ERA-3AED153V; RoHS: Yes; Category: Chip SMD Resistors; Stock 1: 5000; Pricing 1: 1=0.31000, 10=0.26200, 100=0.10240, 500=0.06190, 1000=0.04285, 2500=0.03928 (USD); Mount: Surface Mount; Package: 0603; Case Code (Metric): 1608; Case Code (Imperial): 0603; Contact Plating: Tin; Min Operating Temperature: -55°C; Max Operating Temperature: 155°C; Package Quantity: 5000; Tolerance: 0.5%; Packaging: Tape and Reel; Resistor Type: Thin Film; Number of Terminations: 2; Voltage Rating (DC): 75V; Features: Automotive AEC-Q200; Series: ERA-3A; Resistance Tolerance: 0.5%; Construction: Rectangular; Length: 1.6mm; Width: 0.8mm; Height: 0.45mm; Depth: 0.8mm; Ratings: AEC-Q200; Radiation Hardening: No; Reach SVHC Compliant: Yes; Lead Free: Lead Free; RoHS Compliant: Yes; Military Standard: Not; ComponentLink1URL: https://datasheet.ciiva.com/6138/1776116-6138543.pdf?src-supplier=Farnell; ComponentLink1Description: https://datasheet.ciiva.com/6138/1776116-6138543.pdf?src-supplier=Farnell; ComponentLink2URL: https://datasheet.ciiva.com/7830/1776116-7830921.pdf?src-supplier=Element14; ComponentLink2Description: https://datasheet.ciiva.com/7830/1776116-7830921.pdf?src-supplier=Element14; ComponentLink3URL: https://datasheet.ciiva.com/9117/aoa0000ce26-9117541.pdf?src-supplier=Avnet; ComponentLink3Description: https://datasheet.ciiva.com/9117/aoa0000ce26-9117541.pdf?src-supplier=Avnet; ComponentLink4URL: https://datasheet.ciiva.com/9117/aoa0000ce26-9117535.pdf?src-supplier=Avnet; ComponentLink4Description: https://datasheet.ciiva.com/9117/aoa0000ce26-9117535.pdf?src-supplier=Avnet; ComponentLink5URL: https://datasheet.ciiva.com/30207/54aoa0000ce26-30207227.pdf?src-supplier=Onlinecomponents.com; ComponentLink5Description: https://datasheet.ciiva.com/30207/54aoa0000ce26-30207227.pdf?src-supplier=Onlinecomponents.com; Supplier Part Number 1: P15KBLCT-ND
R220 R223 R224 R227 = ERJ-PB3B1212V: RES SMD 12.1K OHM 0.1% 1/5W 0603; Manufacturer: PANASONIC; Temperature Coefficient: 50ppm/°C; Value: 12.1kΩ; Supplier 1: Newark; Manufacturer Part Number: ERJ-PB3B1212V; RoHS: Yes; Category: Chip SMD Resistors; Stock 1: 2027; Pricing 1: 1=0.02300, 25=0.02300, 50=0.02300, 100=0.02300, 250=0.02300, 500=0.02300, 1000=0.02300 (USD); Package: 0603; Case Code (Metric): 1608; Case Code (Imperial): 0603; Min Operating Temperature: -55°C; Max Operating Temperature: 155°C; Packaging: Tape and Reel; Resistor Type: Thick Film; Number of Terminations: 2; Tolerance: 0.1%; Features: Automotive AEC-Q200; Length: 0.063inch; Width: 0.032inch; Height - Seated (Max): 0.022inch; ComponentLink1URL: https://industrial.panasonic.com/sa/system/files/data/download/catalog/id_fixed-resistors_e_2.pdf?src-supplier=Digi-Key; ComponentLink1Description: https://industrial.panasonic.com/sa/system/files/data/download/catalog/id_fixed-resistors_e_2.pdf?src-supplier=Digi-Key; Supplier Part Number 1: 68AC5970
R221 R225 = RC0603FR-0747KL: RES 47K OHM 1% 1/10W 0603; Manufacturer: YAGEO; Temperature Coefficient: 100ppm/°C; Voltage Rating: 50V; Max Power Dissipation: 100mW; Value: 47kΩ; Supplier 1: Future Electronics; Manufacturer Part Number: RC0603FR-0747KL; RoHS: Yes; Category: Chip SMD Resistors; Stock 1: 21495000; Pricing 1: 5000=0.00150, 50000=0.00140, 200000=0.00140, 625000=0.00130, 2000000=0.00120 (USD); Package: 0603; Number of Pins: 2; Case Code (Metric): 1608; Case Code (Imperial): 0603; Size Code: 0603; Min Operating Temperature: -55°C; Max Operating Temperature: 155°C; Tolerance: 1%; Resistor Type: Thick Film; Packaging: Tape and Reel; Voltage Rating (DC): 50V; Package Quantity: 1; Number of Terminations: 2; Termination: SMD/SMT; Features: Moisture Resistant; Series: RC; Resistance Tolerance: 1%; Technology: THICK FILM; Construction: Rectangular; Length: 0.063inch; Width: 0.031inch; Height: 0.022inch; Depth: 0.8mm; Military Standard: Not; Lead Free: Lead Free; RoHS Compliant: Yes; ComponentLink1URL: https://datasheet.ciiva.com/11808/0900766b80f96399-11808118.pdf?src-supplier=Rs; ComponentLink1Description: https://datasheet.ciiva.com/11808/0900766b80f96399-11808118.pdf?src-supplier=Rs; ComponentLink2URL: https://datasheet.ciiva.com/2453/pyu-r-int-thick-7-2453932.pdf?src-supplier=Digi-Key; ComponentLink2Description: https://datasheet.ciiva.com/2453/pyu-r-int-thick-7-2453932.pdf?src-supplier=Digi-Key; ComponentLink3URL: https://datasheet.ciiva.com/2453/pyu-r-int-thick-7-2453933.pdf?src-supplier=Digi-Key; ComponentLink3Description: https://datasheet.ciiva.com/2453/pyu-r-int-thick-7-2453933.pdf?src-supplier=Digi-Key; ComponentLink4URL: https://datasheet.ciiva.com/2453/pyu-r-int-thick-7-2453931.pdf?src-supplier=Digi-Key; ComponentLink4Description: https://datasheet.ciiva.com/2453/pyu-r-int-thick-7-2453931.pdf?src-supplier=Digi-Key; ComponentLink5URL: https://datasheet.ciiva.com/7746/443971-7746362.pdf?src-supplier=Element14; ComponentLink5Description: https://datasheet.ciiva.com/7746/443971-7746362.pdf?src-supplier=Element14; ComponentLink6URL: https://datasheet.ciiva.com/7746/443971-7746361.pdf?src-supplier=Element14; ComponentLink6Description: https://datasheet.ciiva.com/7746/443971-7746361.pdf?src-supplier=Element14; Supplier Part Number 1: 6616189
U44 = CMP-04895-000282-1: IC POWER 2 CIRCUIT 14HTSSOP; Manufacturer Part Number: ALM2402FQPWPRQ1; Value: N/A; Package: 14-PowerTSSOP
U45-U47 = CMP-0384-02059-2: IC OPAMP GP 1 CIRCUIT TSOT23-5; Generic Part Number: AD8615; Iq/Amp: 1.7mA; V Span Max: 6V; Amplifiers Per Package: 1; Small Signal Bandwidth: 23MHz; Input Offset Voltage: 80uV; V Span Min: 2.7V; Slew Rate: 12V/us; Input Bias Current: 200fA; ComponentLink4URL: http://www.analog.com/en/all-operational-amplifiers-op-amps/operational-amplifiers-op-amps/ad8615/products/product.html#product-recommendations; DatasheetVersion: Rev. E; Code_JEDEC: MO-193-AB; ComponentLink3Description: Package Specification; PackageDescription: 5-Pin Thin Small Outline Transistor Package, Body 2.9 x 1.6 mm, Pitch 0.95 mm; ComponentLink4Description: Reference Circuit; RevisionNote: Reference Circuit URL fixed; ComponentLink1Description: Manufacturer URL; PartNumber: AD8615AUJZ-REEL7; Mounting Technology: Surface Mount; ComponentLink3URL: http:/www.analog.com/static/imported-files/packages/PKG_PDF/TSOT(UJ)/UJ_5.pdf; ComponentLink2URL: http://www.analog.com/static/imported-files/data_sheets/AD8615_8616_8618.pdf; PackageVersion: 100708-A; ComponentLink1URL: http://www.analog.com/en/index.html; ComponentLink2Description: Datasheet; PackageReference: UJ-5; Manufacturer Part Number: AD8615AUJZ-REEL7; Package: TSOT-23-5; Value: N/A